# Altium schematic sheet USB_SERIAL.schdoc
size 236 x 205 mm
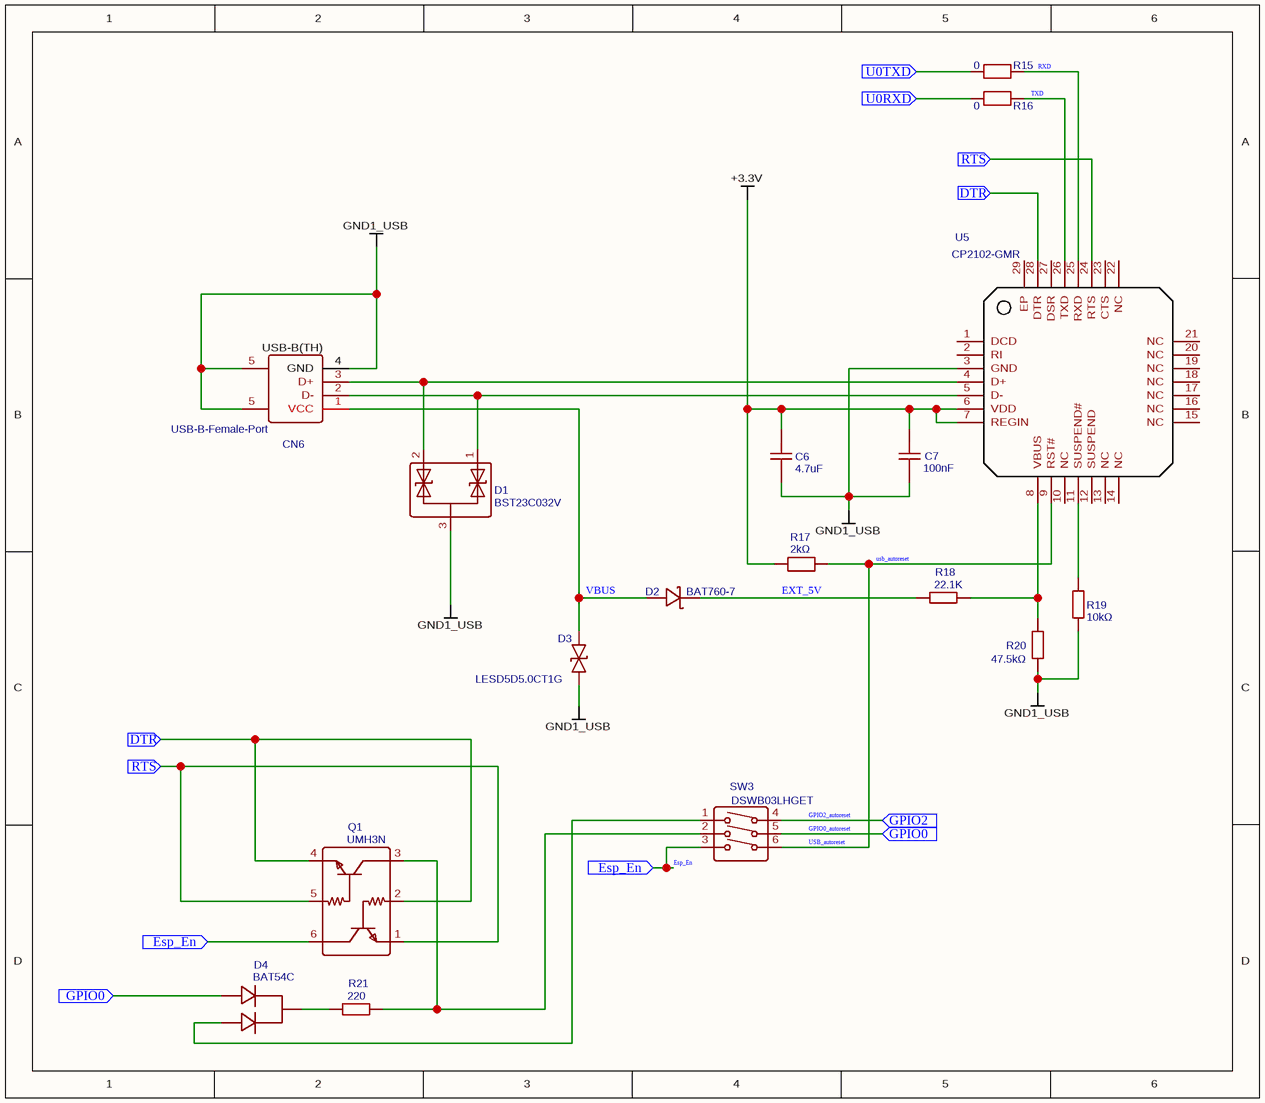
[diagram p0: USB_SERIAL.schdoc]

## Parts
C6  4.7uF  [C0805]
C7  100nF  [C0805]
CN6  USB-B-Female-Port  [USB-B_TH_BF90]
D1  BST23C032V  [SOT-23_L2.9-W1.3-P1.90-LS2.4-BR]
D2  BAT760-7  [SOD-323_L1.8-W1.3-LS2.5-RD]
D3  LESD5D5.0CT1G  [SOD-523_L1.2-W0.8-LS1.6-BI]
D4  BAT54C  [SOT-23-3_L2.9-W1.6-P1.90-LS2.8-BR]
Q1  UMH3N  [SC-70-6_L2.2-W1.3-P0.65-LS2.1-BR]
R15  0  [R0805]
R16  0  [R0805]
R17  2kΩ  [R0805]
R18  22.1K  [R0805]
R19  10kΩ  [R0805]
R20  47.5kΩ  [R0805]
R21  220  [R0805]
SW3  DSWB03LHGET  [SW-TH_DSWB03LHGET]
U5  CP2102-GMR  [QFN-28_L5.0-W5.0-P0.50-BL-EP]

## Ports
DTR (in), Esp_En (in), GPIO0 (in), GPIO2 (in), RTS (in), U0RXD (in), U0TXD (in)

## Nets
+3.3V: C6.2 C7.2 R17.1 U5.6(VDD) U5.7(REGIN)
GND1_USB: C6.1 C7.1 CN6.4(GND) CN6.5(EH) D1.3 D3.1 R19.1 R20.1 U5.3(GND)
DTR: Q1.2(B) Q1.4(E) U5.28(DTR) ; port DTR
Esp_En: Q1.6(C) SW3.3 ; port Esp_En
EXT_5V: D2.1 R18.1
GPIO0_autoreset: D4.1(A1) SW3.5 ; port GPIO0
GPIO2_autoreset: SW3.4 ; port GPIO2
RTS: Q1.1(E) Q1.5(B) U5.24(RTS) ; port RTS
RXD: R15.2 U5.25(RXD)
TXD: R16.2 U5.26(TXD)
U0RXD: R16.1 ; port U0RXD
U0TXD: R15.1 ; port U0TXD
usb_autoreset: R17.2 SW3.6 U5.9(RST#)
VBUS: CN6.1(VCC) D2.2 D3.2
NetCN6_2: CN6.2(D-) D1.1 U5.5(D-)
NetCN6_3: CN6.3(D+) D1.2 U5.4(D+)
NetD4_2: D4.2(A2) SW3.1
NetD4_3: D4.3(K) R21.2
NetQ1_3: Q1.3(C) R21.1 SW3.2
NetR18_2: R18.2 R20.2 U5.8(VBUS)
NetR19_2: R19.2 U5.11(SUSPEND#)

Not connected (* = marked no-connect by the designer): U5 1(DCD) 2(RI) 10(NC) 12(SUSPEND) 13(NC) 14(NC) 15(NC) 16(NC) 17(NC) 18(NC) 19(NC) 20(NC) 21(NC) 22(NC) 23(CTS) 27(DSR) 29(EP)

## Notes on the sheet
- (in symbol USB-B-Female-Port) USB-B(TH)

## Library data of the parts
C6 = 4.7uF: BOM_Manufacturer: Samsung Electro-Mechanics; BOM_Manufacturer Part: CL21A475KQFNNNE; nameAlias: Capacitance; Contributor: LCSC; BOM_Supplier: LCSC; BOM_Supplier Part: C140692; BOM_JLCPCB Part Class: Extended Part; spicePre: C; spiceSymbolName: CL21A475KQFNNNE
C7 = 100nF: BOM_Manufacturer: YAGEO; BOM_Manufacturer Part: CC0805KRX7R8BB104; nameAlias: Capacitance; Contributor: LCSC; BOM_Supplier: LCSC; BOM_Supplier Part: C519981; BOM_JLCPCB Part Class: Extended Part; spicePre: C; spiceSymbolName: CC0805KRX7R8BB104
CN6 = USB-B-Female-Port: BOM_Manufacturer Part: 921-112A1010D10200; BOM_Manufacturer: Jing Extension of the Electronic Co.; BOM_Supplier: LCSC; BOM_Supplier Part: C46393; BOM_JLCPCB Part Class: Extended Part; spicePre: C; spiceSymbolName: USB-B-Female-TH_C46393
D1 = BST23C032V: BOM_Manufacturer: Bourne Semicon (Shenzhen); Contributor: LCSC; BOM_Supplier: LCSC; BOM_Supplier Part: C151968; BOM_Manufacturer Part: BST23C032V; BOM_JLCPCB Part Class: Extended Part; spicePre: D; spiceSymbolName: BST23C032V
D2 = BAT760-7: BOM_Manufacturer: DIODES; Contributor: LCSC; BOM_Supplier: LCSC; BOM_Manufacturer Part: BAT760-7; BOM_Supplier Part: C124187; BOM_JLCPCB Part Class: Extended Part; spicePre: D; spiceSymbolName: BAT760-7
D3 = LESD5D5.0CT1G: BOM_Manufacturer: Leshan Radio; Contributor: LCSC; BOM_Supplier: LCSC; BOM_Supplier Part: C383211; BOM_Manufacturer Part: LESD5D5.0CT1G; BOM_JLCPCB Part Class: Extended Part; spicePre: D; spiceSymbolName: LESD5D5.0CT1G
D4 = BAT54C: BOM_Manufacturer: CJ; BOM_Supplier: LCSC; BOM_Manufacturer Part: BAT54C; BOM_Supplier Part: C2135; BOM_JLCPCB Part Class: Extended Part; spicePre: D; spiceSymbolName: BAT54C
Q1 = UMH3N: BOM_Manufacturer: CJ; BOM_Supplier: LCSC; BOM_Manufacturer Part: UMH3N; BOM_Supplier Part: C62892; BOM_JLCPCB Part Class: Extended Part; spicePre: Q; spiceSymbolName: UMH3N
R15 R16 = 0: BOM_Manufacturer: YAGEO; BOM_Manufacturer Part: AC0805FR-070RL; nameAlias: Resistance (Ohms); Contributor: LCSC; Resistance: 0Ω; BOM_Supplier: LCSC; BOM_Supplier Part: C174076; BOM_JLCPCB Part Class: Extended Part; spicePre: R; spiceSymbolName: AC0805FR-070RL
R17 = 2kΩ: BOM_Manufacturer: Resistor.Today; BOM_Manufacturer Part: PTFR0805B2K00P9; Resistance (Ohms): 2K; nameAlias: Resistance; Contributor: LCSC; BOM_Supplier: LCSC; BOM_Supplier Part: C479096; BOM_JLCPCB Part Class: Extended Part; spicePre: R; spiceSymbolName: PTFR0805B2K00P9
R18 = 22.1K: BOM_Manufacturer: BOURNS; BOM_Manufacturer Part: CR0805-FX-2212ELF; nameAlias: Resistance (Ohms); Contributor: LCSC; Resistance: 22.1kΩ; BOM_Supplier: LCSC; BOM_Supplier Part: C204311; BOM_JLCPCB Part Class: Extended Part; spicePre: R; spiceSymbolName: CR0805-FX-2212ELF
R19 = 10kΩ: BOM_Manufacturer: Ever Ohms Tech; BOM_Manufacturer Part: TR0805D10KP0550; Resistance (Ohms): 10K; nameAlias: Resistance; Contributor: LCSC; BOM_Supplier: LCSC; BOM_Supplier Part: C332266; BOM_JLCPCB Part Class: Extended Part; spicePre: R; spiceSymbolName: TR0805D10KP0550
R20 = 47.5kΩ: BOM_Manufacturer: Uniroyal Elec; BOM_Manufacturer Part: TC0525B4752T5E; Resistance (Ohms): 47.5K; nameAlias: Resistance; Contributor: LCSC; BOM_Supplier: LCSC; BOM_Supplier Part: C79481; BOM_JLCPCB Part Class: Extended Part; spicePre: R; spiceSymbolName: TC0525B4752T5E
R21 = 220: BOM_Manufacturer: YAGEO; BOM_Manufacturer Part: RC0805JR-7W220RL; nameAlias: Resistance (Ohms); Contributor: LCSC; Resistance: 220Ω; BOM_Supplier: LCSC; BOM_Supplier Part: C163392; BOM_JLCPCB Part Class: Extended Part; spicePre: R; spiceSymbolName: RC0805JR-7W220RL
SW3 = DSWB03LHGET: BOM_Manufacturer: Dongguan Guangzhu Industrial; Contributor: LCSC; BOM_Supplier: LCSC; BOM_Supplier Part: C99420; BOM_Manufacturer Part: -; BOM_JLCPCB Part Class: Extended Part; spicePre: S; spiceSymbolName: DSWB03LHGET
U5 = CP2102-GMR: BOM_Manufacturer: SILICON LABS; BOM_Supplier: LCSC; BOM_Manufacturer Part: CP2102-GMR; BOM_Supplier Part: C6568; BOM_JLCPCB Part Class: Basic Part; spicePre: U; spiceSymbolName: CP2102-GMR